# Altium schematic sheet Peripherals.SchDoc
size A4; SheetNumber: 2; SheetTotal: 3
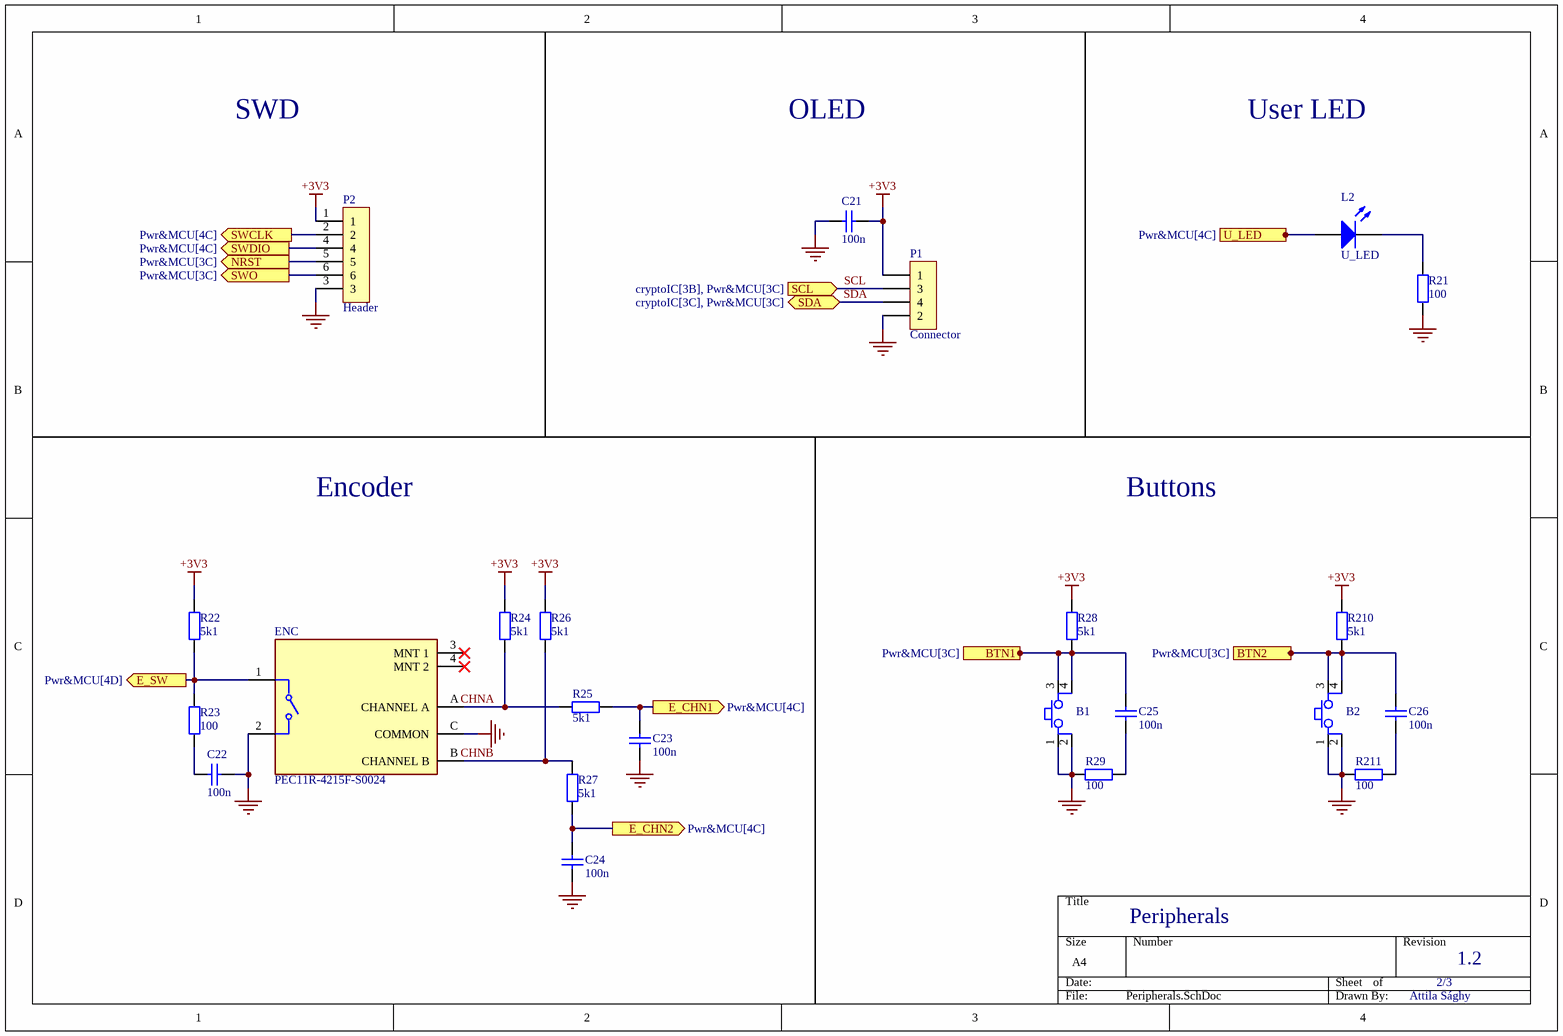
[diagram p0: Peripherals.SchDoc]

## Parts
B1  Button  [FP_BTN_SMD]  (value not drawn)
B2  Button  [FP_BTN_SMD]  (value not drawn)
C21  100n  [FP_0805_CAP_085]
C22  100n  [FP_0805_CAP_085]
C23  100n  [FP_0805_CAP_085]
C24  100n  [FP_0805_CAP_085]
C25  100n  [FP_0805_CAP_085]
C26  100n  [FP_0805_CAP_085]
ENC  PEC11R-4215F-S0024  [FP-PEC11R-4215F-S0024-MFG]
L2  U_LED  [FP_0805_LED_GREEN]
P1  Connector  [FP_CONN4_TUSKE_254MM]
P2  Header  [HEADER6x1]
R21  100  [FP_0805_RES]
R22  5k1  [FP_0805_RES]
R23  100  [FP_0805_RES]
R24  5k1  [FP_0805_RES]
R25  5k1  [FP_0805_RES]
R26  5k1  [FP_0805_RES]
R27  5k1  [FP_0805_RES]
R28  5k1  [FP_0805_RES]
R29  100  [FP_0805_RES]
R210  5k1  [FP_0805_RES]
R211  100  [FP_0805_RES]

## Ports
BTN1 (out, see Pwr&MCU[3C]), BTN2 (out, see Pwr&MCU[3C]), E_CHN1 (out, see Pwr&MCU[4C]), E_CHN2 (out, see Pwr&MCU[4C]), E_SW (out, see Pwr&MCU[4D]), NRST (out, see Pwr&MCU[3C]), SCL (in, see cryptoIC[3B], Pwr&MCU[3C]), SDA (bidir, see cryptoIC[3C], Pwr&MCU[3C]), SWCLK (out, see Pwr&MCU[4C]), SWDIO (out, see Pwr&MCU[4C]), SWO (out, see Pwr&MCU[3C]), U_LED (in, see Pwr&MCU[4C])

## Nets
+3V3: C21.2 P1.1 P2.1 R22.2 R24.2 R26.2 R28.2 R210.2
GND: B1.1 B1.2 B2.1 B2.2 C21.1 C22.1 C23.1 C24.1 ENC.2 ENC.C(COMMON) P1.2 P2.3 R21.1 R29.1 R211.1
BTN1: B1.3 B1.4 C25.2 R28.1 ; port BTN1
BTN2: B2.3 B2.4 C26.2 R210.1 ; port BTN2
CHNA: ENC.A(CHANNEL_A) R24.1 R25.1
CHNB: ENC.B(CHANNEL_B) R26.1 R27.1
E_CHN1: C23.2 R25.2 ; port E_CHN1
E_CHN2: C24.2 R27.2 ; port E_CHN2
E_SW: ENC.1 R22.1 R23.2 ; port E_SW
NRST: P2.5 ; port NRST
SCL: P1.3 ; port SCL
SDA: P1.4 ; port SDA
SWCLK: P2.2 ; port SWCLK
SWDIO: P2.4 ; port SWDIO
SWO: P2.6 ; port SWO
U_LED: L2.1(A) ; port U_LED
NetC22_2: C22.2 R23.1
NetC25_1: C25.1 R29.2
NetC26_1: C26.1 R211.2
NetL2_2: L2.2(K) R21.2

Not connected (* = marked no-connect by the designer): ENC 3(MNT_1)* 4(MNT_2)*

## Notes on the sheet
- SWD
- OLED
- User LED
- Encoder
- Buttons
- Peripherals
- 2/3
- 1.2
- Attila Sághy

## Library data of the parts
B1 B2 = Button 4P: Push button
C21-C26 = CAP: Capacitor; Value: 100n
ENC = CMP-1747-00012-2: ROTARY ENCODER MECHANICAL 24PPR; Hole Diameter: 1.8mm; Output Type: Quadrature; Pulses per Revolution: 24; Number of Channels: 2; Built in Switch: Yes; Min Operating Temperature: -30°C; Series: PEC11R; Type: Mechanical; Package Quantity: 150; Length: 21.5mm; Max Operating Temperature: 70°C; Encoder Type: Mechanical; Height: 13.4mm; Detent: Yes; Packaging: Bulk; Orientation: Vertical; Width: 12.5mm; Termination: PC Pins; Mount: Through Hole; REACH SVHC: No SVHC; Radiation Hardening: No; RoHS Compliant: Yes
L2 = LED: Typical RED GaAs LED; pin to pad: 1>A 2>K
P1 = Header4
P2 = Header6
R21-R29 R210 R211 = RES: Resistor
  R21 R23 R29 R211: Value: 100
  R22 R24-R28 R210: Value: 5k1